# Altium schematic sheet DAC.SchDoc
size A4; Organization: HTL Hollabrunn; Address1: Abteilung Elektronik; Address2: Anton Ehrenfried-Straße 10; Address3: 2020 Hollabrunn; SPICEModelCacheALEDFFPD: <root> / <DocumentId>ALEDFFPD</DocumentId> / <CacheFrame Number="0"> / <Model Name="cap" Kind="MDL"> / <Text>*Default semiconductor capacitor / .MODEL CAP C()</Text> / </Model> / </CacheFrame> / </root>
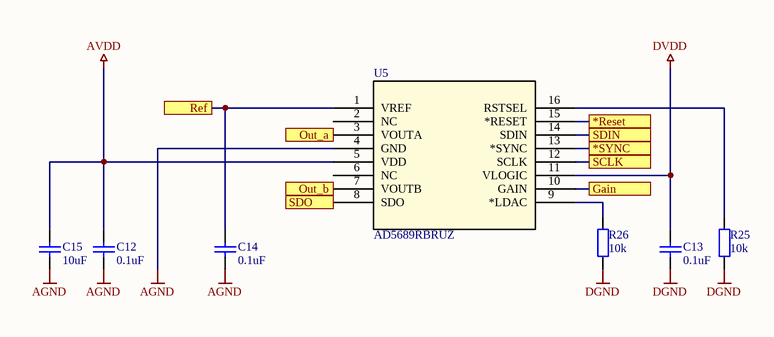
[diagram p0: DAC.SchDoc]

## Parts
C12  0.1uF  [C1206-KUE]
C13  0.1uF  [C1206-KUE]
C14  0.1uF  [C1206-KUE]
C15  10uF  [C1206-KUE]
R25  10k  [C1206-KUE]
R26  10k  [C1206-KUE]
U5  AD5689RBRUZ  [RU_16_ADI]

## Ports
*Reset, *SYNC, Gain, Out_a, Out_b, Ref, SCLK, SDIN, SDO

## Nets
AGND: C12.1 C14.1 C15.1 U5.4(GND)
AVDD: C12.2 C15.2 U5.5(VDD)
DGND: C13.1 R25.2 R26.2
DVDD: C13.2 U5.11(VLOGIC)
*Reset: U5.15(*RESET) ; port *Reset
*SYNC: U5.13(*SYNC) ; port *SYNC
Gain: U5.10(GAIN) ; port Gain
Out_a: U5.3(VOUTA) ; port Out_a
Out_b: U5.7(VOUTB) ; port Out_b
Ref: C14.2 U5.1(VREF) ; port Ref
SCLK: U5.12(SCLK) ; port SCLK
SDIN: U5.14(SDIN) ; port SDIN
SDO: U5.8(SDO) ; port SDO
NetR25_1: R25.1 U5.16(RSTSEL)
NetR26_1: R26.1 U5.9(*LDAC)

Not connected (* = marked no-connect by the designer): U5 2(NC) 6(NC)

## Notes on the sheet
- Title
- Size:
- Date:
- A4
- Number:
- Time:
- Revision:
- Sheet
- of
- HTL Hollabrunn
- Abteilung Elektronik
- Anton Ehrenfried-Straße 10
- 2020 Hollabrunn
- File:
- Drawn By:

## Library data of the parts
C12-C15 = Capacitor: Manufacturer: Kemet; Bezeichnung: Kerko +-10% 63V; Published: 8-Jun-2000; LatestRevisionDate: 17-Jul-2002; LatestRevisionNote: Re-released for DXP Platform.; PackageReference: RAD-0.3; Publisher: Altium Limited; PackageDescription: Radial Cap, Thru-Hole; 2 Leads; 0.3 in Pin Spacing; Orderingcode: *
  C12-C14: Value: 0.1uF
  C15: Value: 10uF
R25 R26 = ResistorSMD: Resistor SMD; Manufacturer: AVX; Bezeichnung: SMD Wid. 1/8W 2%; Published: 8-Jun-2000; LatestRevisionDate: 17-Jul-2002; LatestRevisionNote: Re-released for DXP Platform.; PackageReference: AXIAL-0.4; Publisher: Altium Limited; PackageDescription: Axial Device, Thru-Hole; 2 Leads; 0.4 in Pin Spacing; Value: 10k; Orderingcode: *
U5 = AD5689RBRUZ: Dual, 16-Bit nanoDAC+ with 2 ppm/Â°C Reference, SPI Interface; Manufacturer_Name: Analog Devices Inc; Copyright: Copyright (C) 2026 Ultra Librarian. All rights reserved.; Manufacturer_Part_Number: AD5689RBRUZ; RefDes: RefDes; Type: Type